# EAGLE design esp8266-01relayfababesp-12-conplanodemasa-prueba12-F (EAGLE 7.6.0)
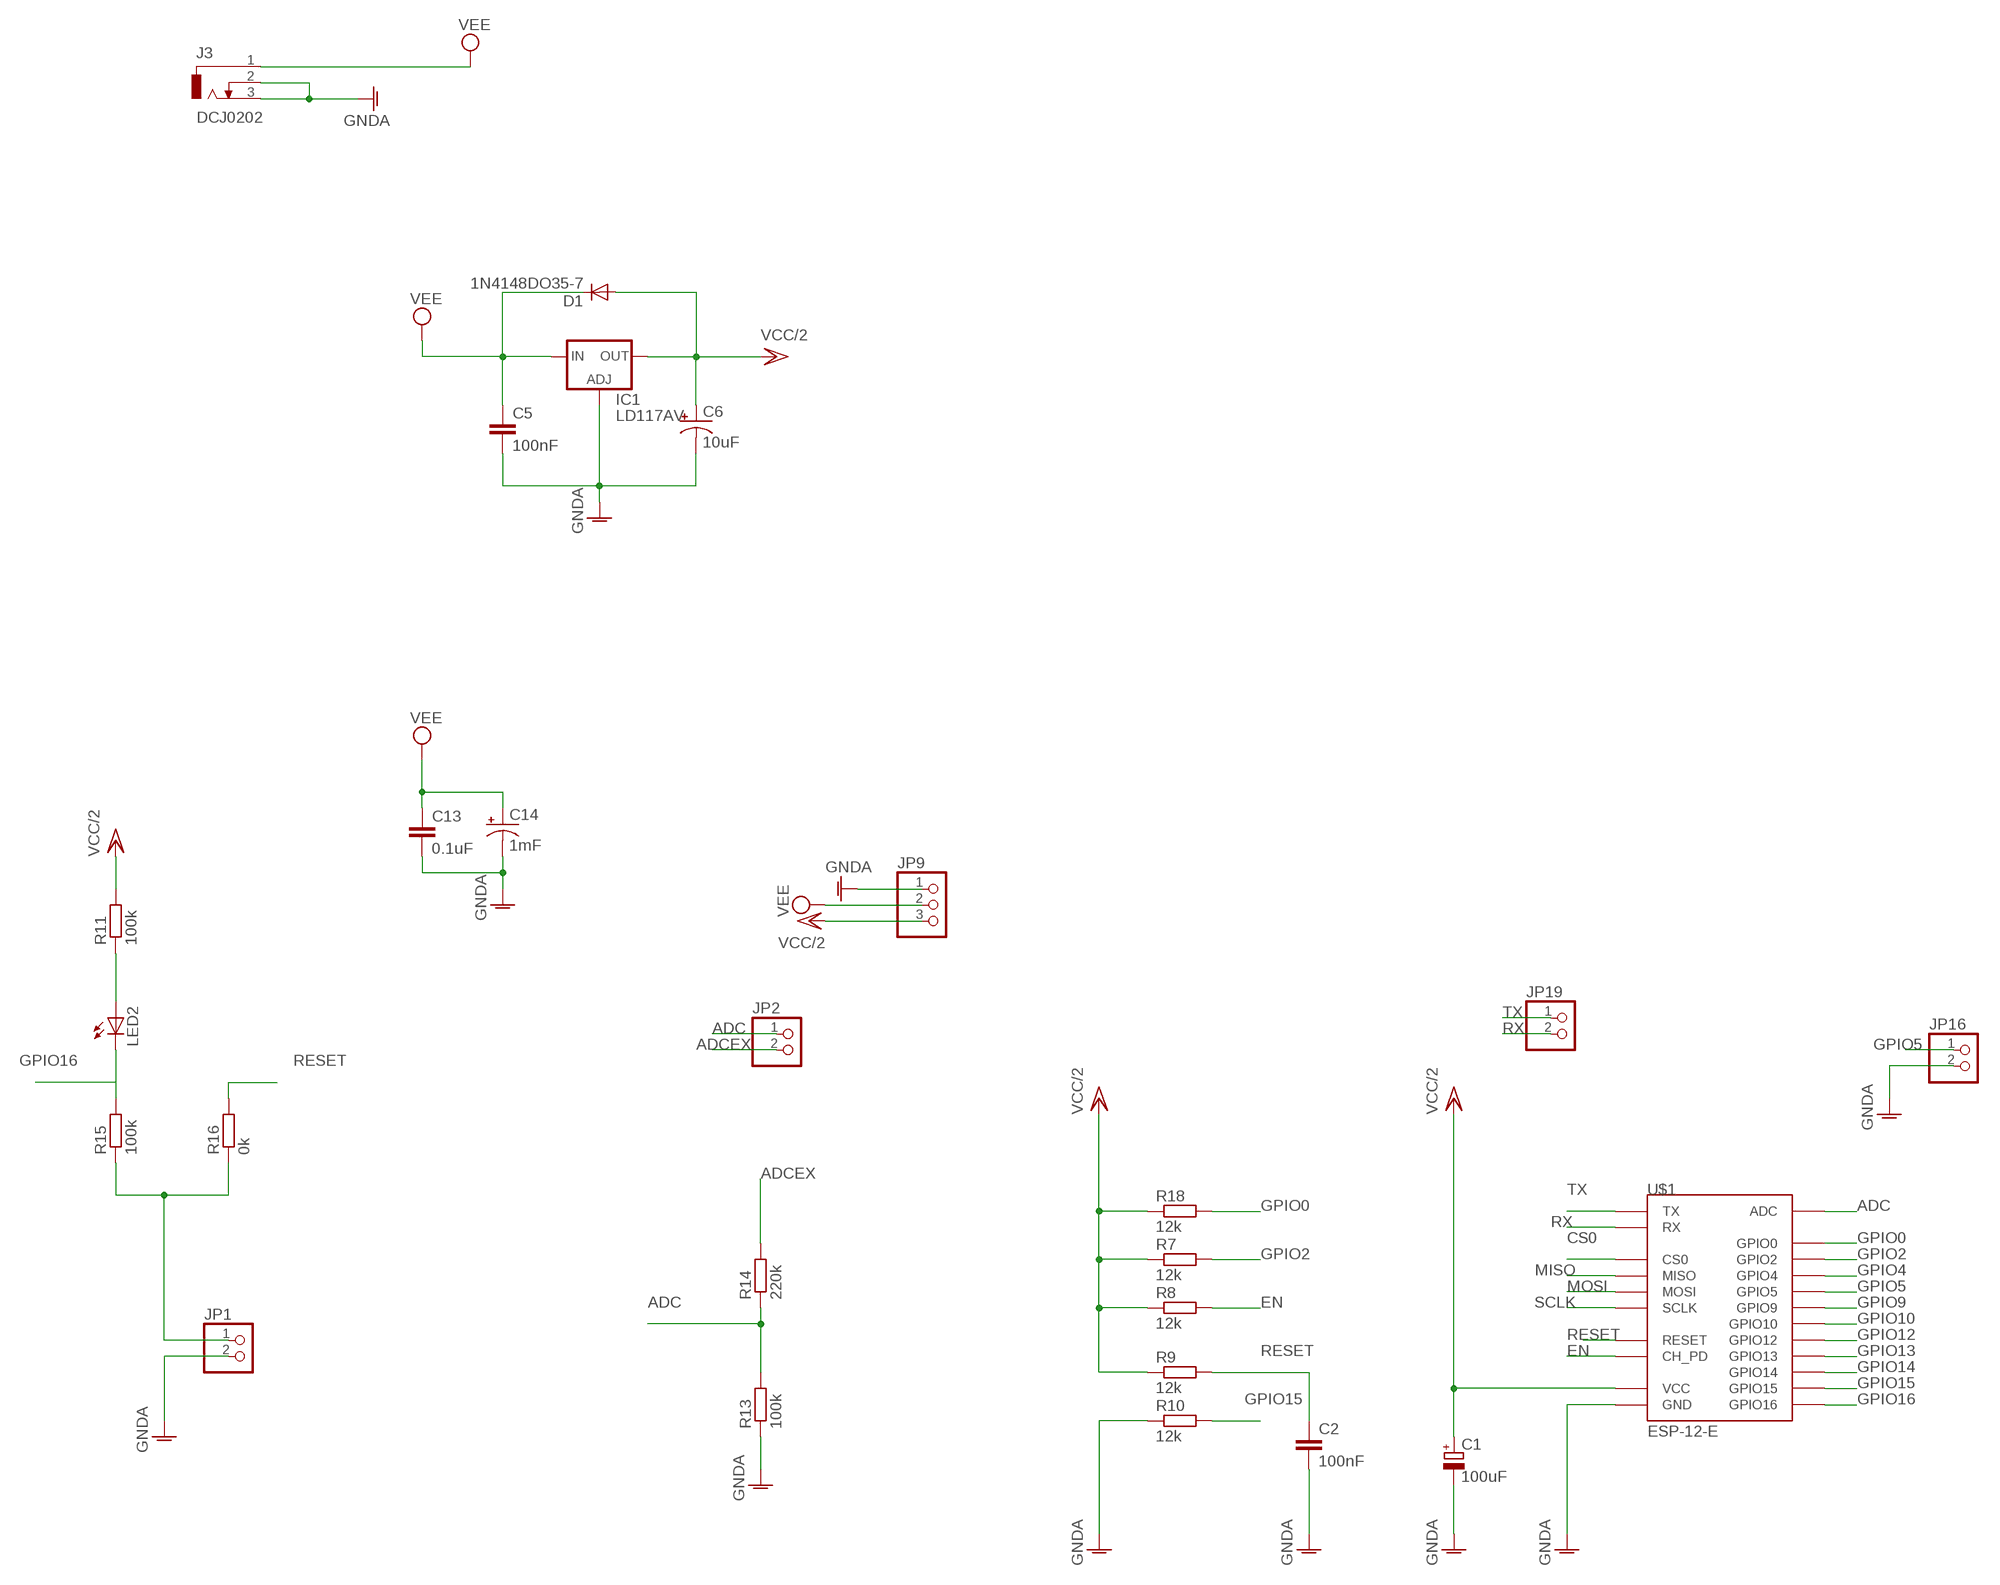
[diagram p0: schematic, sheet 1, part 1 of 2]
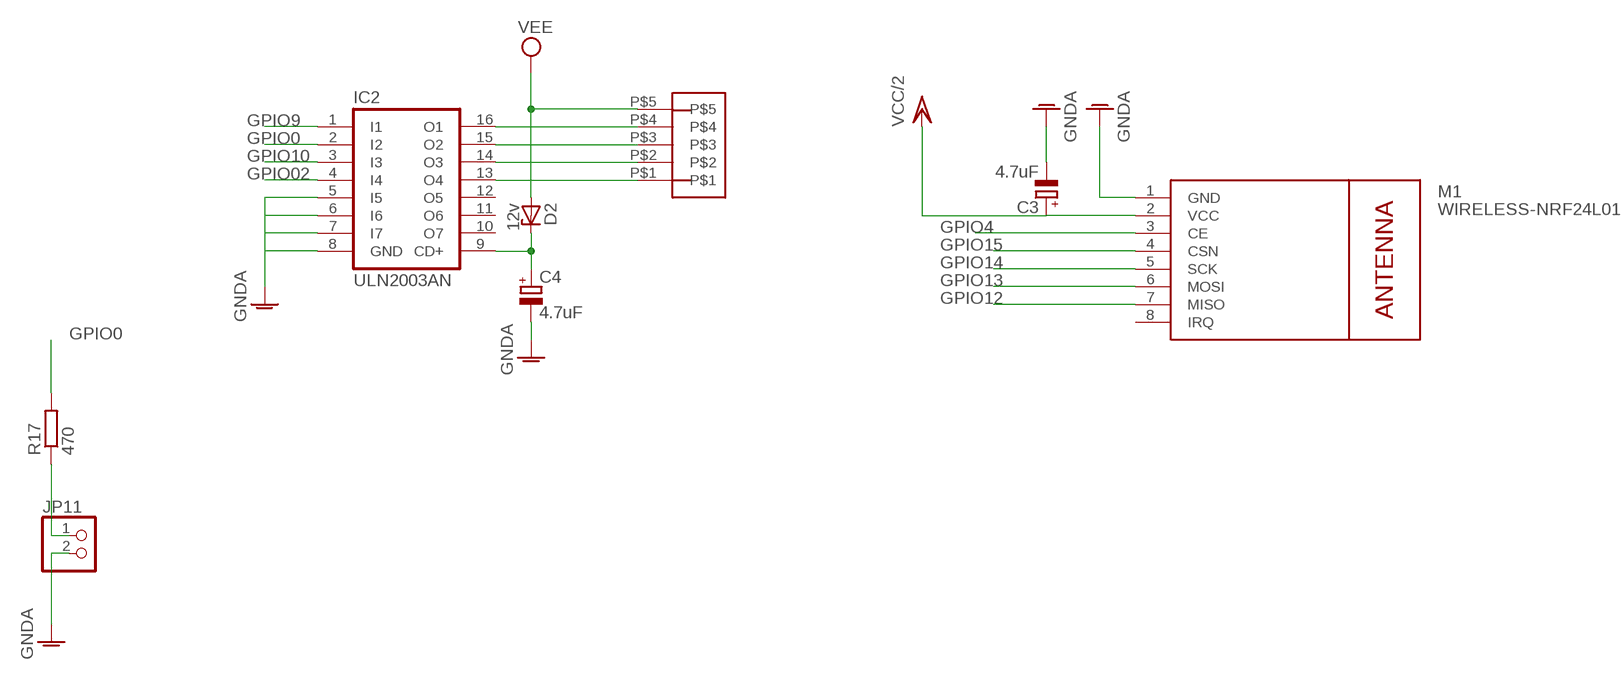
[diagram p1: schematic, sheet 1, part 2 of 2]

## Parts
C1  100uF  CPOL-EUTT5D7  [TT5D7]
C2  100nF  C-EU025-024X044  [C025-024X044]
C3  4.7uF  CPOL-EUTT5D7  [TT5D7]
C4  4.7uF  CPOL-EUTT5D7  [TT5D7]
C5  100nF  C-EU025-025X050  [C025-025X050]
C6  10uF  CPOL-USE2,5-6E  [E2,5-6E]
C13  0.1uF  C-EU025-025X050  [C025-025X050]
C14  1mF  CPOL-USE2,5-6E  [E2,5-6E]
D1  1N4148DO35-7  [DO35-7]
D2  12v  ZENER-DIODEP1-12  [P1Z12]
IC1  LD117AV  [TO220L1]
IC2  ULN2003AN  [DIL16]
J3  DCJ0202  [DCJ0202]
JP1  PINHD-1X2  [1X02]
JP2  PINHD-1X2  [1X02]
JP9  PINHD-1X3  [1X03]
JP11  PINHD-1X2  [1X02]
JP16  PINHD-1X2  [1X02]
JP19  PINHD-1X2  [1X02]
LED2  LED3MM  [LED3MM]
M1  WIRELESS-NRF24L01  [WIRELESS-NRF24L01]
R7  12k  R-EU_0207/7  [0207/7]
R8  12k  R-EU_0207/7  [0207/7]
R9  12k  R-EU_0207/7  [0207/7]
R10  12k  R-EU_0207/7  [0207/7]
R11  100k  R-EU_0207/7  [0207/7]
R13  100k  R-EU_0207/7  [0207/7]
R14  220k  R-EU_0207/7  [0207/7]
R15  100k  R-EU_0207/7  [0207/7]
R16  0k  R-EU_0207/7  [0207/7]
R17  470  R-EU_0207/7  [0207/7]
R18  12k  R-EU_0207/7  [0207/7]
U$1  ESP-12-E  [ESP-12-E]
U$3  5_PIN_JST-XH  [5_PIN_JST-XH]

## Nets
ADC: JP2.1 R13.2 R14.1 U$1.ADC
ADCEX: JP2.2 R14.2
CS0: U$1.CS0
EN: R8.2 U$1.CH_PD
GNDA: C1.- C2.2 C3.- C4.- C5.2 C6.- C13.2 C14.- IC1.1(ADJ) IC2.5(I5) IC2.6(I6) IC2.7(I7) IC2.8(GND) J3.2 J3.3 JP1.2 JP9.1 JP11.2 JP16.2 M1.1(GND) R10.1 R13.1 U$1.GND
GPIO0: IC2.2(I2) R17.2 R18.2 U$1.GPIO0
GPIO2: R7.2 U$1.GPIO2
GPIO02: IC2.4(I4)
GPIO4: M1.3(CE) U$1.GPIO4
GPIO5: JP16.1 U$1.GPIO5
GPIO9: IC2.1(I1) U$1.GPIO9
GPIO10: IC2.3(I3) U$1.GPIO10
GPIO12: M1.7(MISO) U$1.GPIO12
GPIO13: M1.6(MOSI) U$1.GPIO13
GPIO14: M1.5(SCK) U$1.GPIO14
GPIO15: M1.4(CSN) R10.2 U$1.GPIO15
GPIO16: LED2.K(C) R15.2 U$1.GPIO16
MISO: U$1.MISO
MOSI: U$1.MOSI
N$3: IC2.16(O1) U$3.P$4
N$5: IC2.15(O2) U$3.P$3
N$10: IC2.14(O3) U$3.P$2
N$13: JP11.1 R17.1
N$16: IC2.13(O4) U$3.P$1
N$22: LED2.A R11.1
N$24: C4.+ D2.C IC2.9(CD+)
N$26: JP1.1 R15.1 R16.1
RESET: C2.1 R9.2 R16.2 U$1.RESET
RX: JP19.2 U$1.RX
SCLK: U$1.SCLK
TX: JP19.1 U$1.TX
VCC/2: C1.+ C3.+ C6.+ D1.A IC1.2(OUT) JP9.3 M1.2(VCC) R7.1 R8.1 R9.1 R11.2 R18.1 U$1.VCC
VEE: C5.1 C13.1 C14.+ D1.C D2.A IC1.3(IN) J3.1 JP9.2 U$3.P$5
Unconnected: IC2.10(O7) IC2.11(O6) IC2.12(O5) M1.8(IRQ)

## Library data of the parts
C1 C3 C4 = resistor:CPOL-EU: POLARIZED CAPACITOR, European symbol
C2 C5 C13 = rcl:C-EU: CAPACITOR, European symbol
C6 C14 = rcl:CPOL-US: POLARIZED CAPACITOR, American symbol
D1 = diode:1N4148: DIODE high speed (Philips)
D2 = diode:ZENER-DIODE: Z-Diode
IC1 = v-reg:LD117A?*: Low drop fixed and adjustable positive voltage regulators 1 A Source: http://www.st.com/stonline/products/literature/ds/7194/ld1117axx.pdf
IC2 = uln-udn:ULN2003A: DRIVER ARRAY
J3 = con-jack:DCJ0202: DC POWER JACK Source: DCJ0202.pdf; OC_FARNELL: unknown; OC_NEWARK: unknown
JP1 JP2 JP11 JP16 JP19 = pinhead:PINHD-1X2: PIN HEADER
JP9 = pinhead:PINHD-1X3: PIN HEADER
LED2 = led:LED: LED OSRAM: - CHIPLED LG R971, LG N971, LY N971, LG Q971, LY Q971, LO R971, LY R971 LH N974, LH R974 LS Q976, LO Q976, LY Q976 LO Q996 - Hyper CHIPLED LW Q18S LB Q993, LB Q99A, LB R99A - SideLED LS A670, LO A670, LY A670, LG A670, LP A670 LB A673, LV A673, LT A673, LW A673 LH A674 LY A675 LS A676, LA A676, LO A676, LY A676, LW A676 LS A679, LY A679, LG A679 - Hyper Micro SIDELED® LS Y876, LA Y876, LO Y876, LY Y876 LT Y87S - SmartLED LW L88C, LW L88S LB L89C, LB L89S, LG L890 LS L89K, LO L89K, LY L89K LS L896, LA L896, LO L896, LY L896 - TOPLED LS T670, LO T670, LY T670, LG T670, LP T670 LSG T670, LSP T670, LSY T670, LOP T670, LYG T670 LG T671, LOG T671, LSG T671 LB T673, LV T673, LT T673, LW T673 LH T674 LS T676, LA T676, LO T676, LY T676, LB T676, LH T676, LSB T676, LW T676 LB T67C, LV T67C, LT T67C, LS T67K, LO T67K, LY T67K, LW E67C LS E67B, LA E67B, LO E67B, LY E67B, LB E67C, LV E67C, LT E67C LW T67C LS T679, LY T679, LG T679 LS T770, LO T770, LY T770, LG T770, LP T770 LB T773, LV T773, LT T773, LW T773 LH T774 LS E675, LA E675, LY E675, LS T675 LS T776, LA T776, LO T776, LY T776, LB T776 LHGB T686 LT T68C, LB T68C - Hyper Mini TOPLED® LB M676 - Mini TOPLED Santana® LG M470 LS M47K, LO M47K, LY M47K Source: http://www.osram.convergy.de LUXEON: - LUMILED® LXK2-PW12-R00, LXK2-PW12-S00, LXK2-PW14-U00, LXK2-PW14-V00 LXK2-PM12-R00, LXK2-PM12-S00, LXK2-PM14-U00 LXK2-PE12-Q00, LXK2-PE12-R00, LXK2-PE12-S00, LXK2-PE14-T00, LXK2-PE14-U00 LXK2-PB12-K00, LXK2-PB12-L00, LXK2-PB12-M00, LXK2-PB14-N00, LXK2-PB14-P00, LXK2-PB14-Q00 LXK2-PR12-L00, LXK2-PR12-M00, LXK2-PR14-Q00, LXK2-PR14-R00 LXK2-PD12-Q00, LXK2-PD12-R00, LXK2-PD12-S00 LXK2-PH12-R00, LXK2-PH12-S00 LXK2-PL12-P00, LXK2-PL12-Q00, LXK2-PL12-R00 Source: www.luxeon.com KINGBRIGHT: KA-3528ASYC Source: www.kingbright.com
M1 = diy-modules:WIRELESS-NRF24L01: 2.4 GHz Wireless Module based on NRF24L01 chip More details available here: http://www.electrodragon.com/w/NRF24L01 Click here to find device on ebay.com <http://www.ebay.com/sch/nrf24l01+arduino>
R7-R11 R13-R18 = resistor:R-EU_: RESISTOR, European symbol
U$1 = johs_esp8266_lib_frank_esp12e_mod:ESP-12-E: ESP8266 Wifi Module ESP-12-E; DIMENSIONS: 24.0 x 16.0 mm; PINS: 22; PITCH: 0.078" / 2 mm
U$3 = JST-XH_HEADERS:5_PIN_JST-XH

## Net classes
1 power: width 1.016 mm

## Board
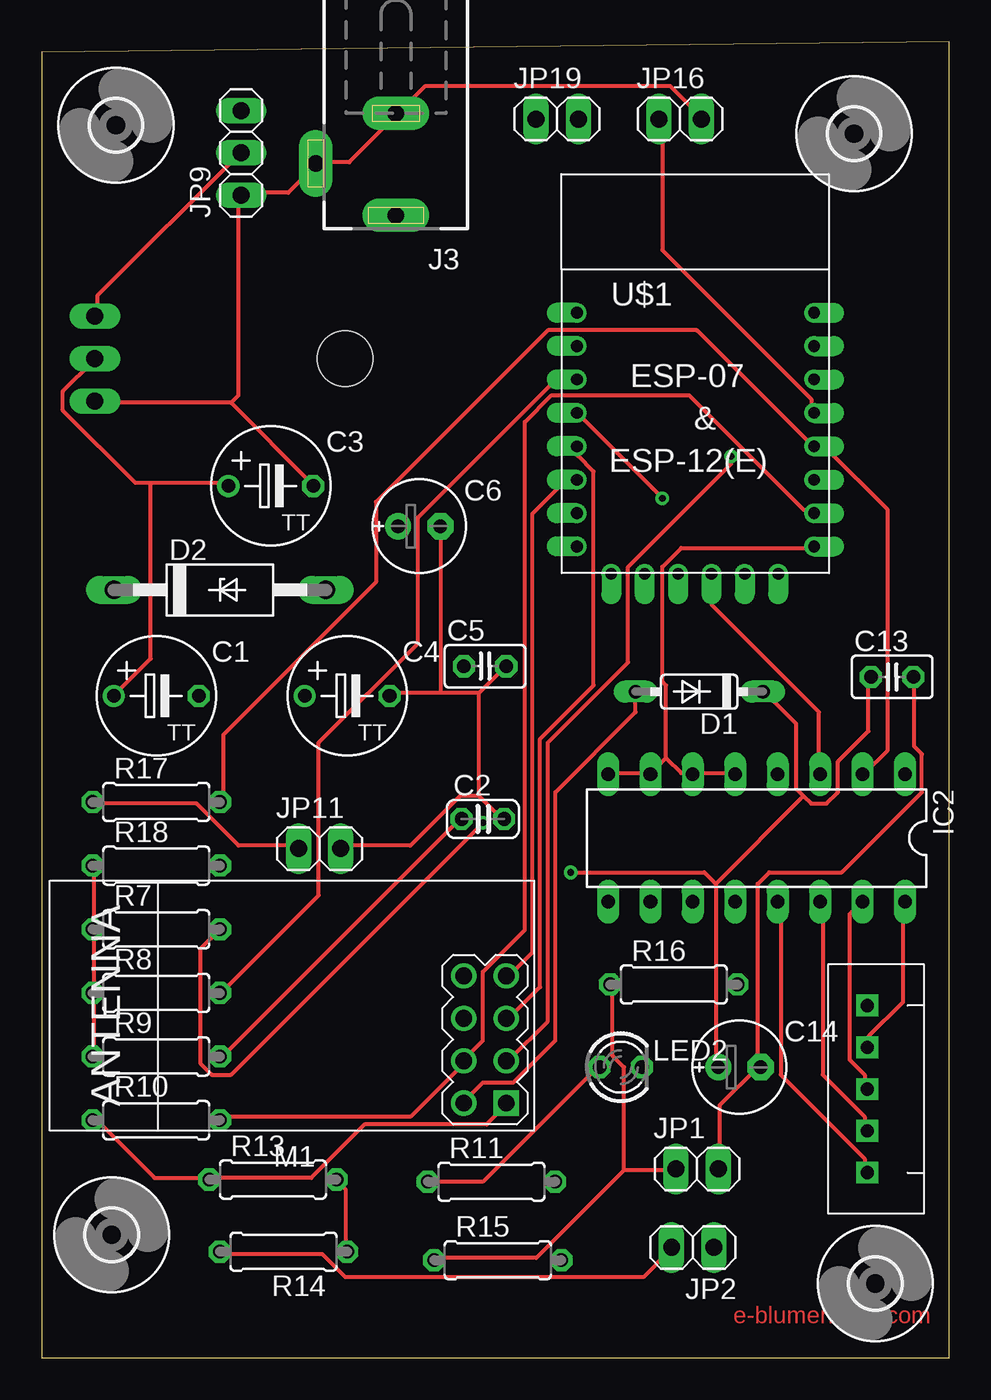
[diagram p2: board, top side]
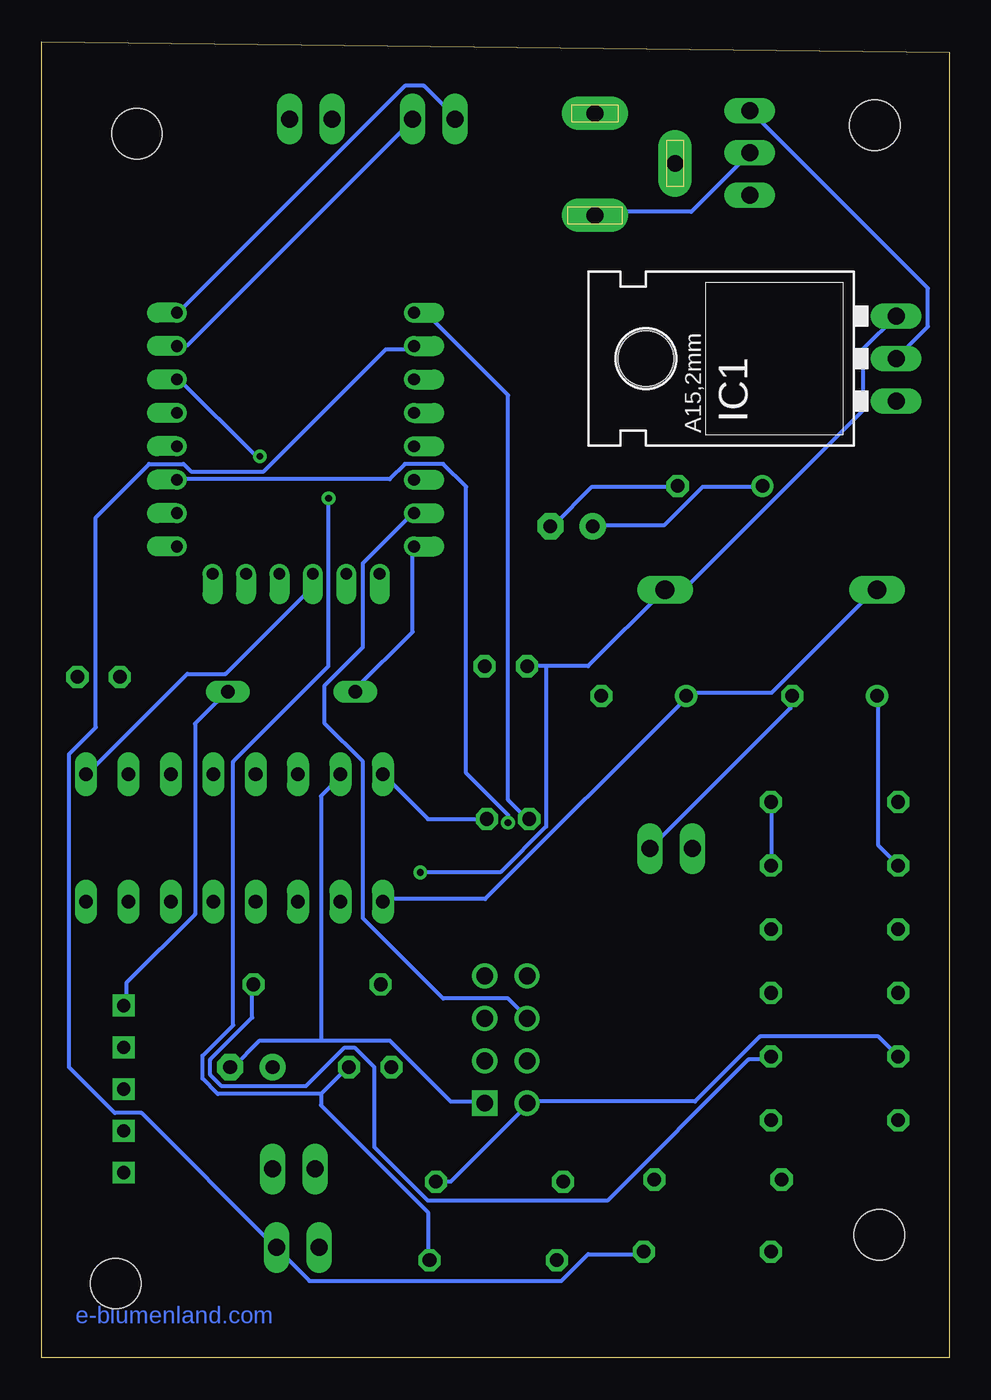
[diagram p3: board, bottom side, seen from below]

Size 54.34 x 78.79 mm. Coordinates in mm from the lower left corner, seen from the top.
Outline: 0,0 54.34,0 54.34,78.79 0,78.16 0,0
Copper layers (1*16): Top 0.035mm / dielectric 1.5mm / Bottom 0.035mm
Design rules "default *": minimum track width 10mil, minimum drill 16mil, track to track 8mil, track to pad 8mil, pad to pad 8mil, via to via 8mil, smd to smd 8mil, copper to edge 40mil, drill to drill 8mil, minimum pad ring 10mil, minimum via ring 8mil, stop-mask expansion 4mil, vias tented up to drill 0mil, thermal gap 10mil

### Footprints (pad centres in the part's own frame; a part is rotated, then mirrored left to right if it is on the bottom)
TT5D7 = drill 0.813: + -2.54,0 | drill 0.813 octagon: - 2.54,0
C025-024X044 = drill 0.813 octagon: 1 -1.27,0; 2 1.27,0
C025-025X050 = drill 0.813 octagon: 1 -1.27,0; 2 1.27,0
E2,5-6E = drill 0.813 pad 1.575: + -1.27,0 | drill 0.813 pad 1.575 octagon: - 1.27,0
DO35-7 = drill 0.813 long: A 3.81,0; C -3.81,0
P1Z12 = drill 1.118 long: A 6.35,0; C -6.35,0
3,0 = hole 3: 0,0
TO220L1 = drill 1.016 long: 1 -2.54,-3.81; 2 0,-3.81; 3 2.54,-3.81 | hole 3.302: 0,11.176
DIL16 = drill 0.813 long: 1 -8.89,-3.81; 2 -6.35,-3.81; 3 -3.81,-3.81; 4 -1.27,-3.81; 5 1.27,-3.81; 6 3.81,-3.81; 7 6.35,-3.81; 8 8.89,-3.81; 9 8.89,3.81; 10 6.35,3.81; 11 3.81,3.81; 12 1.27,3.81; 13 -1.27,3.81; 14 -3.81,3.81; 15 -6.35,3.81; 16 -8.89,3.81
DCJ0202 = drill 1 pad 2 long: 1 0,3.1; 2 4.8,0; 3 0,-3
1X02 = drill 1.016 long: 1 -1.27,0; 2 1.27,0
1X03 = drill 1.016 long: 1 -2.54,0; 2 0,0; 3 2.54,0
LED3MM = drill 0.813 octagon: A -1.27,0; K 1.27,0
WIRELESS-NRF24L01 = drill 1 square: 1 -12.7,6.35 | drill 1: 2 -10.16,6.35; 3 -12.7,3.81; 4 -10.16,3.81; 5 -12.7,1.27; 6 -10.16,1.27; 7 -12.7,-1.27; 8 -10.16,-1.27
0207/7 = drill 0.813 octagon: 1 -3.81,0; 2 3.81,0
ESP-12-E = drill 0.7 offset: ADC -7.2,3.8; CH_PD -7.2,1.8; CS0 -5.14,-9.838; GND 7,-8.2; GPIO0 7,-2.2; GPIO2 7,-4.2; GPIO4 7,1.8; GPIO5 7,-0.2; GPIO9 -1.14,-9.838; GPIO10 0.86,-9.838; GPIO12 -7.2,-4.2; GPIO13 -7.2,-6.2; GPIO14 -7.2,-2.2; GPIO15 7,-6.2; GPIO16 -7.2,-0.2; MISO -3.14,-9.838; MOSI 2.86,-9.838; RESET -7.2,5.8; RX 7,3.8; SCLK 4.86,-9.838; TX 7,5.8; VCC -7.2,-8.2
5_PIN_JST-XH = drill 0.8 square: P$1 2.45,3.4; P$2 4.95,3.4; P$3 7.45,3.4; P$4 9.95,3.4; P$5 12.45,3.4

### Placement (x,y rotation side)
C1  6.86,39.62 0 top
C2  26.42,32.26 0 top
C3  13.72,52.2 0 top
C4  18.29,39.62 0 top
C5  26.54,41.4 0 top
C6  22.61,49.78 0 top
C13  50.93,40.77 0 top
C14  41.78,17.4 0 top
D1  39.37,39.88 180 top
D2  10.67,45.97 0 top
H1  MOUNT-HOLE3.0  [3,0]  4.45,73.79 0 top
H2  MOUNT-HOLE3.0  [3,0]  48.64,73.28 0 top
H7  MOUNT-HOLE3.0  [3,0]  4.19,7.37 0 top
H8  MOUNT-HOLE3.0  [3,0]  49.91,4.45 0 top
IC1  6.98,59.82 90 bottom
IC2  42.8,31.12 180 top
J3  21.21,71.5 180 top
JP1  39.24,11.3 0 top
JP2  38.99,6.6 180 top
JP9  11.94,72.14 90 top
JP11  16.64,30.48 0 top
JP16  38.23,74.17 0 top
JP19  30.86,74.17 0 top
LED2  34.67,17.4 0 top
M1  15.11,21.59 180 top
R7  6.86,25.65 0 top
R8  6.86,21.84 0 top
R9  6.86,18.03 0 top
R10  6.86,14.22 0 top
R11  26.92,10.54 0 top
R13  13.84,10.67 0 top
R14  14.48,6.35 180 top
R15  27.31,5.84 0 top
R16  37.85,22.35 0 top
R17  6.86,33.27 0 top
R18  6.86,29.46 0 top
U$1  39.24,56.77 0 top
U$3  52.83,8.64 90 top

### Tracks (layer width: path | path; a pad name or v marks a point on that pad's centre or on a via)
ADC
  Top 0.254: R14.1 18.19,6.43 18.19,10.08 17.73,10.54 R13.2
  Bottom 0.254: U$1.ADC 32.13,60.38 33.73,60.38 41.05,53.06 45.39,53.06 45.85,53.52 47.9,53.52 51.11,50.32 51.11,37.74 52.71,36.14 52.71,17.4 49.96,14.66 48.36,14.66 40.36,6.66 JP2.1 40.13,6.43 38.3,4.6 23.22,4.6 21.62,6.2 18.42,6.2 R14.1
ADCEX
  Top 0.254: R14.2 10.87,6.2 16.81,6.2 18.19,4.83 36.02,4.83 37.62,6.43 JP2.2
EN
  Top 0.254: U$1.CH_PD 31.9,58.55 30.76,58.55 22.53,50.32 22.53,42.77 16.59,36.83 16.59,27.69 10.87,21.97 R8.2
GNDA
  Top 0.254: R10.1 3.1,14.43 6.76,10.77 9.96,10.77 R13.1 10.19,10.77 16.13,10.77 19.33,13.97 26.65,13.97 27.79,15.11 M1.1 | 42.88,17.4 42.88,28.37 43.56,29.06 47.9,29.06 52.71,33.86 52.71,36.14 52.25,36.6 52.25,40.72 C13.2 | 42.88,17.4 40.59,15.11 40.59,11.46 JP1.2 | 42.88,17.4 C14.- | JP16.2 39.45,74.32 37.62,76.15 22.99,76.15 21.39,74.55 J3.3 21.16,74.32 18.42,71.58 16.59,71.58 J3.2 16.36,71.35 14.76,69.75 12.01,69.75 JP9.1 11.79,69.52 11.79,57.63 11.33,57.18 | 11.33,57.18 3.33,57.18 IC1.1 | 11.33,57.18 16.13,52.38 C3.- | 37.39,35.92 37.39,40.26 37.16,40.49 37.16,47.35 38.3,48.49 46.08,48.49 U$1.GND | 37.39,35.92 36.47,35 IC2.7 36.25,35 33.96,35 IC2.8 | 38.99,35 38.3,35 37.39,35.92 | 38.99,35 41.5,35 IC2.5 | 38.99,35 IC2.6 | 26.19,39.8 23.9,39.8 | 23.9,39.8 20.93,39.8 C4.- | 26.19,39.8 27.79,41.4 C5.2 | 26.19,33.63 26.19,39.8 | 26.19,33.63 27.56,32.26 C2.2 | 26.19,33.63 25.04,33.63 22.07,30.66 17.96,30.66 JP11.2 | 23.9,39.8 23.9,49.63 C6.-
  Bottom 0.254: 37.62,19 41.28,19 42.88,17.4 C14.- | 37.62,19 33.5,19 29.84,15.34 28.02,15.34 M1.1 | C3.- 16.36,52.15 21.39,52.15 23.67,49.86 C6.- | JP11.2 9.5,38.89 9.5,39.57 C1.- | C2.2 31.22,32.26 33.73,34.77 IC2.8 | 37.62,19 37.62,33.63 36.47,34.77 IC2.7
GPIO0
  Top 0.254: IC2.2 49.28,35 50.65,36.37 50.65,50.78 46.99,54.43 46.3,54.43 U$1.GPIO0 46.08,54.66 39.22,61.52 30.3,61.52 20.02,51.23 20.02,46.43 10.87,37.29 10.87,33.4 R17.2
  Bottom 0.254: R18.2 10.64,29.52 10.64,33.17 R17.2
GPIO2  (via drill 0.41)
  Top 0.254: v26.42,32.03 11.33,16.94 10.19,16.94 9.5,17.63 9.5,24.49 R7.2
  Bottom 0.254: v26.42,32.03 26.42,32.49 28.93,35 28.93,52.15 30.3,53.52 32.59,53.52 33.5,52.6 46.08,52.6 U$1.GPIO2
GPIO4  (via drill 0.41)
  Top 0.254: v41.28,53.98 41.28,53.52 35.1,47.35 35.1,41.63 30.3,36.83 30.3,20.14 28.02,17.86 M1.3
  Bottom 0.254: v41.28,53.98 41.5,53.98 46.08,58.55 U$1.GPIO4
GPIO5
  Top 0.254: U$1.GPIO5 46.08,56.72 46.08,57.4 37.16,66.32 37.16,74.09 JP16.1
GPIO9
  Bottom 0.254: U$1.GPIO9 38.3,46.89 38.3,45.97 43.33,40.95 45.62,40.95 51.56,35 IC2.1
GPIO10
  Top 0.254: U$1.GPIO10 40.13,46.89 40.13,45.06 46.53,38.66 46.53,35 IC2.3
GPIO12
  Top 0.254: U$1.GPIO12 31.9,52.38 31.22,52.38 29.39,50.55 29.39,24.26 28.02,22.89 M1.7
GPIO13
  Bottom 0.254: U$1.GPIO13 32.13,50.55 35.1,47.57 35.1,42.55 37.39,40.26 37.39,37.97 35.1,35.69 35.1,26.31 30.3,21.51 26.42,21.51 25.27,20.37 M1.6
GPIO14
  Top 0.254: U$1.GPIO14 32.13,54.43 32.13,53.98 33.05,53.06 33.05,40.26 29.84,37.06 29.84,22.2 28.02,20.37 M1.5
GPIO15
  Top 0.254: U$1.GPIO15 46.08,50.78 45.62,50.78 38.76,57.63 30.53,57.63 28.93,56.03 28.93,25.63 26.42,23.11 26.42,19 25.27,17.86 M1.4 25.27,17.63 22.07,14.43 10.87,14.43 R10.2
GPIO16  (via drill 0.41)
  Top 0.254: v37.16,51.46 32.13,56.49 U$1.GPIO16
  Bottom 0.254: v37.16,51.46 37.16,41.4 42.88,35.69 42.88,19.91 44.7,18.09 44.7,16.71 43.79,15.8 37.62,15.8 | 37.62,15.8 36.02,17.4 LED2.K | 37.62,15.8 37.62,15.11 31.22,8.71 31.22,5.97 R15.2
N$3
  Top 0.254: U$3.P$4 49.51,18.77 49.51,19.23 51.56,21.29 51.56,27.23 IC2.16
N$5
  Top 0.254: U$3.P$3 49.28,16.26 49.28,16.94 48.36,17.86 48.36,26.54 49.05,27.23 IC2.15
N$10
  Top 0.254: U$3.P$2 49.28,13.74 49.28,14.43 46.76,16.94 46.76,27.23 IC2.14
N$13
  Top 0.254: R17.1 3.1,33.17 9.27,33.17 11.79,30.66 15.22,30.66 JP11.1
N$16
  Top 0.254: U$3.P$1 49.28,11.23 49.28,11.91 44.25,16.94 44.25,27.23 IC2.13
N$22
  Top 0.254: R11.1 26.42,10.54 33.27,17.4 LED2.A
N$24
  Bottom 0.254: D2.C 4.47,45.97 10.64,39.8 15.67,39.8 C4.+ 15.67,39.57 27.79,27.46 33.73,27.46 IC2.9
N$26
  Top 0.254: 34.87,11.23 29.62,5.97 23.67,5.97 R15.1 | 34.87,11.23 37.85,11.23 JP1.1 | 34.87,11.23 34.87,17.4 34.19,18.09 34.19,22.2 R16.1
RESET
  Top 0.254: R9.2 10.87,18.09 25.04,32.26 C2.1
  Bottom 0.254: U$1.RESET 31.9,62.43 31.22,62.43 26.42,57.63 26.42,33.4 25.27,32.26 C2.1 | R16.2 41.73,22.2 41.73,20.37 44.25,17.86 44.25,16.94 43.56,16.26 38.53,16.26 36.25,18.54 35.56,18.54 34.42,17.4 34.42,12.6 31.22,9.4 20.47,9.4 12.01,17.86 10.87,17.86 R9.2
RX
  Bottom 0.254: U$1.RX 46.08,60.6 45.62,60.6 32.13,74.09 JP19.2
TX
  Bottom 0.254: U$1.TX 46.08,62.66 32.59,76.15 31.45,76.15 29.62,74.32 JP19.1
VCC/2
  Top 0.254: 6.53,52.38 11.1,52.38 C3.+ | 6.53,52.38 5.61,52.38 1.27,56.72 1.27,57.86 3.1,59.69 IC1.2 | R9.1 3.1,18.09 3.1,21.74 R8.1 3.1,21.97 3.1,25.63 R7.1 3.1,25.86 3.1,29.29 R18.1 | D1.A 35.56,38.66 30.76,33.86 30.76,19 28.25,16.49 26.42,16.49 25.27,15.34 M1.2 | 6.53,52.38 6.53,41.86 4.47,39.8 C1.+
  Bottom 0.254: C3.+ 11.33,52.15 14.76,52.15 17.04,49.86 21.16,49.86 C6.+ | JP9.3 11.79,74.55 1.27,64.03 1.27,61.75 3.1,59.92 IC1.2 | U$1.VCC 32.13,48.49 32.13,43.46 35.56,40.03 D1.A | R11.2 29.84,10.54 25.27,15.11 M1.2 25.27,15.34 15.22,15.34 11.33,19.23 4.24,19.23 R9.1 | R18.1 4.24,30.66 4.24,39.57 C1.+
VEE  (via drill 0.41)
  Top 0.254: 45.62,33.63 45.16,34.09 45.16,37.97 43.33,39.8 D1.C | 45.62,33.63 46.08,33.17 46.99,33.17 47.68,33.86 47.68,35.69 49.51,37.52 49.51,40.72 C13.1 | 40.36,28.37 40.36,17.4 C14.+ | 45.62,33.63 40.36,28.37 | IC1.3 3.33,62.43 3.33,63.58 11.79,72.03 JP9.2 | 40.36,28.37 39.68,29.06 v31.67,29.06
  Bottom 0.254: U$3.P$5 49.28,21.29 49.28,22.43 45.16,26.54 45.16,37.97 43.33,39.8 D1.C | 24.13,41.4 21.62,41.4 17.04,45.97 D2.A 15.9,45.97 5.16,56.72 5.16,60.38 IC1.3 | 24.13,41.4 C5.1 | J3.1 21.16,68.61 15.44,68.61 12.01,72.03 JP9.2 | v31.67,29.06 26.87,29.06 24.13,31.8 24.13,41.4

### Text on the board
Top: e-blumenland.com
Bottom: e-blumenland.com